# EAGLE schematic CDevBoard (EAGLE 9.6.2)

## Sheet 1 of 2
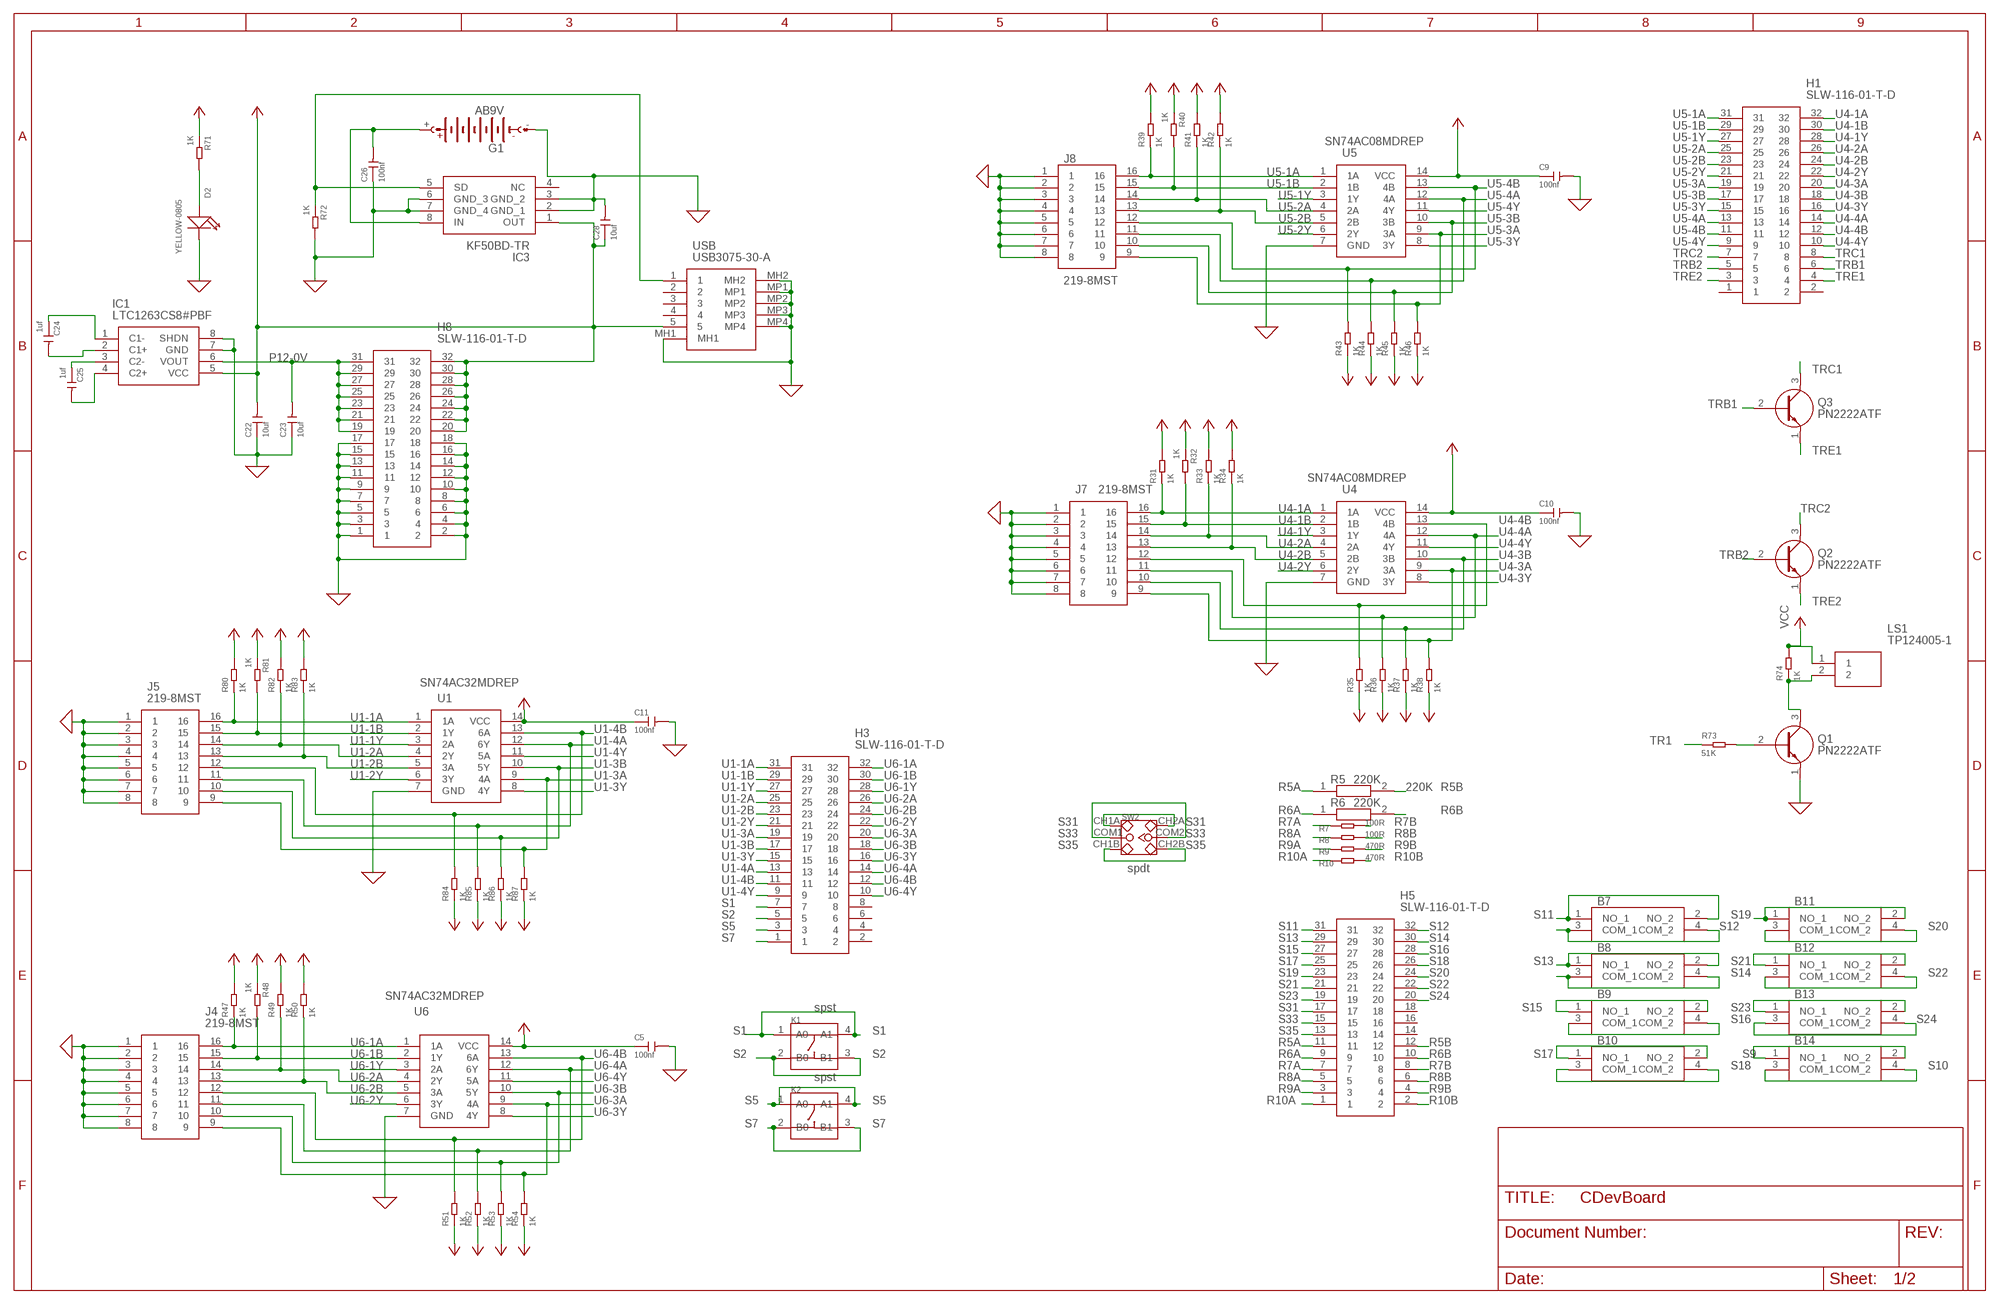
[diagram p0: schematic, sheet 1]

### Parts
B7  1301.9317  [13019317]
B8  1301.9317  [13019317]
B9  1301.9317  [13019317]
B10  1301.9317  [13019317]
B11  1301.9317  [13019317]
B12  1301.9317  [13019317]
B13  1301.9317  [13019317]
B14  1301.9317  [13019317]
C5  100nf  CERAMIC-100NF-25V-10%-X7R(0402)  [C0402]
C9  100nf  CERAMIC-100NF-25V-10%-X7R(0402)  [C0402]
C10  100nf  CERAMIC-100NF-25V-10%-X7R(0402)  [C0402]
C11  100nf  CERAMIC-100NF-25V-10%-X7R(0402)  [C0402]
C22  10uf  CERAMIC-10UF-25V-10%-X5R(0805)  [C0805]
C23  10uf  CERAMIC-10UF-25V-10%-X5R(0805)  [C0805]
C24  1uf  CERAMIC-1UF-25V-10%-X7R(0805)  [C0805]
C25  1uf  CERAMIC-1UF-25V-10%-X7R(0805)  [C0805]
C26  100nf  CERAMIC-100NF-50V-10%-X7R(0603)  [C0603]
C28  10uf  CERAMIC-10UF-25V-10%-X5R(0805)  [C0805]
D2  YELLOW-0805  SMD-LED-CLEAR-YELLOW(0805)  [LED-0805]
G1  AB9V  [AB9V]
H1  SLW-116-01-T-D  [SLW-116-01-X]
H3  SLW-116-01-T-D  [SLW-116-01-X]
H5  SLW-116-01-T-D  [SLW-116-01-X]
H8  SLW-116-01-T-D  [SLW-116-01-X]
IC1  LTC1263CS8#PBF  [SOIC127P599X175-8N]
IC3  KF50BD-TR  LM2936QHBMA-5.0_NOPB  [SOIC127P600X175-8N]
J4  219-8MST  [2198MST]
J5  219-8MST  [2198MST]
J7  219-8MST  [2198MST]
J8  219-8MST  [2198MST]
K1  SMD-SWITCH-TACTILE-SPST-NO(4P-D6.0MM)  [SW4-SMD-6.0X6.0X5.0MM]
K2  SMD-SWITCH-TACTILE-SPST-NO(4P-D6.0MM)  [SW4-SMD-6.0X6.0X5.0MM]
LS1  TP124005-1  [TP1240051]
Q1  PN2222ATF  [KA431AZTA]
Q2  PN2222ATF  [KA431AZTA]
Q3  PN2222ATF  [KA431AZTA]
R5  220K  CFR-25JR-52-100R  [RESAD1590W60L630D240]
R6  220K  CFR-25JR-52-100R  [RESAD1590W60L630D240]
R7  100R  DIP-RES-100R-5%-1/4W(PR-D2.3XL6.5MM)  [PR-D2.3XL6.5MM]
R8  100R  DIP-RES-100R-5%-1/4W(PR-D2.3XL6.5MM)  [PR-D2.3XL6.5MM]
R9  470R  DIP-RES-470R-5%-1/4W(PR-D2.3XL6.5MM)  [PR-D2.3XL6.5MM]
R10  470R  DIP-RES-470R-5%-1/4W(PR-D2.3XL6.5MM)  [PR-D2.3XL6.5MM]
R31  1K  SMD-RES-5.1K-1%-1/8W(0805)  [R0805]
R32  1K  SMD-RES-5.1K-1%-1/8W(0805)  [R0805]
R33  1K  SMD-RES-5.1K-1%-1/8W(0805)  [R0805]
R34  1K  SMD-RES-5.1K-1%-1/8W(0805)  [R0805]
R35  1K  SMD-RES-5.1K-1%-1/8W(0805)  [R0805]
R36  1K  SMD-RES-5.1K-1%-1/8W(0805)  [R0805]
R37  1K  SMD-RES-5.1K-1%-1/8W(0805)  [R0805]
R38  1K  SMD-RES-5.1K-1%-1/8W(0805)  [R0805]
R39  1K  SMD-RES-5.1K-1%-1/8W(0805)  [R0805]
R40  1K  SMD-RES-5.1K-1%-1/8W(0805)  [R0805]
R41  1K  SMD-RES-5.1K-1%-1/8W(0805)  [R0805]
R42  1K  SMD-RES-5.1K-1%-1/8W(0805)  [R0805]
R43  1K  SMD-RES-5.1K-1%-1/8W(0805)  [R0805]
R44  1K  SMD-RES-5.1K-1%-1/8W(0805)  [R0805]
R45  1K  SMD-RES-5.1K-1%-1/8W(0805)  [R0805]
R46  1K  SMD-RES-5.1K-1%-1/8W(0805)  [R0805]
R47  1K  SMD-RES-5.1K-1%-1/8W(0805)  [R0805]
R48  1K  SMD-RES-5.1K-1%-1/8W(0805)  [R0805]
R49  1K  SMD-RES-5.1K-1%-1/8W(0805)  [R0805]
R50  1K  SMD-RES-5.1K-1%-1/8W(0805)  [R0805]
R51  1K  SMD-RES-5.1K-1%-1/8W(0805)  [R0805]
R52  1K  SMD-RES-5.1K-1%-1/8W(0805)  [R0805]
R53  1K  SMD-RES-5.1K-1%-1/8W(0805)  [R0805]
R54  1K  SMD-RES-5.1K-1%-1/8W(0805)  [R0805]
R71  1K  SMD-RES-200R-1%-1/8W(0805)  [R0805]
R72  1K  SMD-RES-5.1K-1%-1/8W(0805)  [R0805]
R73  51K  SMD-RES-51K-1%-1/10W(0603)  [R0603]
R74  1K  SMD-RES-1K-1%-1/8W(0805)  [R0805]
R80  1K  SMD-RES-5.1K-1%-1/8W(0805)  [R0805]
R81  1K  SMD-RES-5.1K-1%-1/8W(0805)  [R0805]
R82  1K  SMD-RES-5.1K-1%-1/8W(0805)  [R0805]
R83  1K  SMD-RES-5.1K-1%-1/8W(0805)  [R0805]
R84  1K  SMD-RES-5.1K-1%-1/8W(0805)  [R0805]
R85  1K  SMD-RES-5.1K-1%-1/8W(0805)  [R0805]
R86  1K  SMD-RES-5.1K-1%-1/8W(0805)  [R0805]
R87  1K  SMD-RES-5.1K-1%-1/8W(0805)  [R0805]
SW2  DIP-TOGGLE-SWITCH-2CH-(2X3P-2.54)  [SW6-2.54-9.0X3.5X3.2+2.0MM]
U1  SN74AC04MDREP  [SOIC127P600X175-14N]
U4  SN74AC08MDREP  [SOIC127P600X175-14N]
U5  SN74AC08MDREP  [SOIC127P600X175-14N]
U6  SN74AC04MDREP  [SOIC127P600X175-14N]
USB  USB3075-30-A  [USB307530A]

### Nets
0 [Power]: C5.2 C9.2 C10.2 C11.2 C22.1 C23.1 C26.1 C28.2 D2.- G1.- H8.1 H8.2 H8.3 H8.4 H8.5 H8.6 H8.7 H8.8 H8.9 H8.10 H8.11 H8.12 H8.13 H8.14 H8.15 H8.16 H8.17 H8.18 IC1.7(GND) IC1.8(SHDN) IC3.2(GND_1) IC3.3(GND_2) IC3.6(GND_3) IC3.7(GND_4) J4.1 J4.2 J4.3 J4.4 J4.5 J4.6 J4.7 J4.8 J5.1 J5.2 J5.3 J5.4 J5.5 J5.6 J5.7 J5.8 J7.1 J7.2 J7.3 J7.4 J7.5 J7.6 J7.7 J7.8 J8.1 J8.2 J8.3 J8.4 J8.5 J8.6 J8.7 J8.8 Q1.1(E) R72.2 U1.7(GND) U4.7(GND) U5.7(GND) U6.7(GND) USB.MH1 USB.MH2 USB.MP1 USB.MP2 USB.MP3 USB.MP4 ; supply symbol labelled GND ; also sheet 2
N$2: Q1.2(B) R73.2
N$3: LS1.2 Q1.3(C) R74.1
N$4: IC3.5(SD) R72.1 USB.1
N$5: C24.1 IC1.1(C1-)
N$6: C24.2 IC1.2(C1+)
N$7: C25.1 IC1.3(C2-)
N$8: C25.2 IC1.4(C2+)
N$11: C26.2 G1.+ IC3.8(IN)
N$67: D2.+ R71.2
P12-0V: C23.2 H8.19 H8.21 H8.23 H8.25 H8.27 H8.29 H8.31 IC1.6(VOUT)
R5A: H5.11 R5.1
R5B: H5.12 R5.2
R6A: H5.9 R6.1
R6B: H5.10 R6.2
R7A: H5.7 R7.1
R7B: H5.8 R7.2
R8A: H5.5 R8.1
R8B: H5.6 R8.2
R9A: H5.3 R9.1
R9B: H5.4 R9.2
R10A: H5.1 R10.1
R10B: H5.2 R10.2
S1: H3.7 K1.1(A0) K1.4(A1)
S2: H3.5 K1.2(B0) K1.3(B1)
S5: H3.3 K2.1(A0) K2.4(A1)
S7: H3.1 K2.2(B0) K2.3(B1)
S9: B14.1(NO_1) B14.2(NO_2) ; also sheet 2
S10: B14.3(COM_1) B14.4(COM_2) ; also sheet 2
S11: B7.1(NO_1) B7.2(NO_2) H5.31
S12: B7.3(COM_1) B7.4(COM_2) H5.32
S13: B8.1(NO_1) B8.2(NO_2) H5.29
S14: B8.3(COM_1) B8.4(COM_2) H5.30
S15: B9.1(NO_1) B9.2(NO_2) H5.27
S16: B9.3(COM_1) B9.4(COM_2) H5.28
S17: B10.1(NO_1) B10.2(NO_2) H5.25
S18: B10.3(COM_1) B10.4(COM_2) H5.26
S19: B11.1(NO_1) B11.2(NO_2) H5.23
S20: B11.3(COM_1) B11.4(COM_2) H5.24
S21: B12.1(NO_1) B12.2(NO_2) H5.21
S22: B12.3(COM_1) B12.4(COM_2) H5.22
S23: B13.1(NO_1) B13.2(NO_2) H5.19
S24: B13.3(COM_1) B13.4(COM_2) H5.20
S31: H5.17 SW2.CH1A SW2.CH2A
S33: H5.15 SW2.COM1 SW2.COM2
S35: H5.13 SW2.CH1B SW2.CH2B
TR1: R73.1 ; also sheet 2
TRB1: H1.6 Q3.2(B)
TRB2: H1.5 Q2.2(B)
TRC1: H1.8 Q3.3(C)
TRC2: H1.7 Q2.3(C)
TRE1: H1.4 Q3.1(E)
TRE2: H1.3 Q2.1(E)
U1-1A: H3.31 J5.16 R80.1 U1.1(1A)
U1-1B: H3.29 J5.15 R81.2 U1.2(1Y)
U1-1Y: H3.27 U1.3(2A)
U1-2A: H3.25 J5.14 R82.1 U1.4(2Y)
U1-2B: H3.23 J5.13 R83.1 U1.5(3A)
U1-2Y: H3.21 U1.6(3Y)
U1-3A: H3.19 J5.9 R87.2 U1.9(4A)
U1-3B: H3.17 J5.10 R86.2 U1.10(5Y)
U1-3Y: H3.15 U1.8(4Y)
U1-4A: H3.13 J5.11 R85.2 U1.12(6Y)
U1-4B: H3.11 J5.12 R84.2 U1.13(6A)
U1-4Y: H3.9 U1.11(5A)
U4-1A: H1.32 J7.16 R31.1 U4.1(1A)
U4-1B: H1.30 J7.15 R32.2 U4.2(1B)
U4-1Y: H1.28 U4.3(1Y)
U4-2A: H1.26 J7.14 R33.1 U4.4(2A)
U4-2B: H1.24 J7.13 R34.1 U4.5(2B)
U4-2Y: H1.22 U4.6(2Y)
U4-3A: H1.20 J7.9 R38.2 U4.9(3A)
U4-3B: H1.18 J7.10 R37.2 U4.10(3B)
U4-3Y: H1.16 U4.8(3Y)
U4-4A: H1.14 J7.11 R36.2 U4.12(4A)
U4-4B: H1.12 J7.12 R35.2 U4.13(4B)
U4-4Y: H1.10 U4.11(4Y)
U5-1A: H1.31 J8.16 R39.1 U5.1(1A)
U5-1B: H1.29 J8.15 R40.2 U5.2(1B)
U5-1Y: H1.27 U5.3(1Y)
U5-2A: H1.25 J8.14 R41.1 U5.4(2A)
U5-2B: H1.23 J8.13 R42.1 U5.5(2B)
U5-2Y: H1.21 U5.6(2Y)
U5-3A: H1.19 J8.9 R46.2 U5.9(3A)
U5-3B: H1.17 J8.10 R45.2 U5.10(3B)
U5-3Y: H1.15 U5.8(3Y)
U5-4A: H1.13 J8.11 R44.2 U5.12(4A)
U5-4B: H1.11 J8.12 R43.2 U5.13(4B)
U5-4Y: H1.9 U5.11(4Y)
U6-1A: H3.32 J4.16 R47.1 U6.1(1A)
U6-1B: H3.30 J4.15 R48.2 U6.2(1Y)
U6-1Y: H3.28 U6.3(2A)
U6-2A: H3.26 J4.14 R49.1 U6.4(2Y)
U6-2B: H3.24 J4.13 R50.1 U6.5(3A)
U6-2Y: H3.22 U6.6(3Y)
U6-3A: H3.20 J4.9 R54.2 U6.9(4A)
U6-3B: H3.18 J4.10 R53.2 U6.10(5Y)
U6-3Y: H3.16 U6.8(4Y)
U6-4A: H3.14 J4.11 R52.2 U6.12(6Y)
U6-4B: H3.12 J4.12 R51.2 U6.13(6A)
U6-4Y: H3.10 U6.11(5A)
VCC [Power]: C5.1 C9.1 C10.1 C11.1 C22.2 C28.1 H8.20 H8.22 H8.24 H8.26 H8.28 H8.30 H8.32 IC1.5(VCC) IC3.1(OUT) LS1.1 R31.2 R32.1 R33.2 R34.2 R35.1 R36.1 R37.1 R38.1 R39.2 R40.1 R41.2 R42.2 R43.1 R44.1 R45.1 R46.1 R47.2 R48.1 R49.2 R50.2 R51.1 R52.1 R53.1 R54.1 R71.1 R74.2 R80.2 R81.1 R82.2 R83.2 R84.1 R85.1 R86.1 R87.1 U1.14(VCC) U4.14(VCC) U5.14(VCC) U6.14(VCC) USB.5 ; also sheet 2
Unconnected: H1.1 H1.2 H3.2 H3.4 H3.6 H3.8 H5.14 H5.16 H5.18 IC3.4(NC) USB.2 USB.3 USB.4

## Sheet 2 of 2
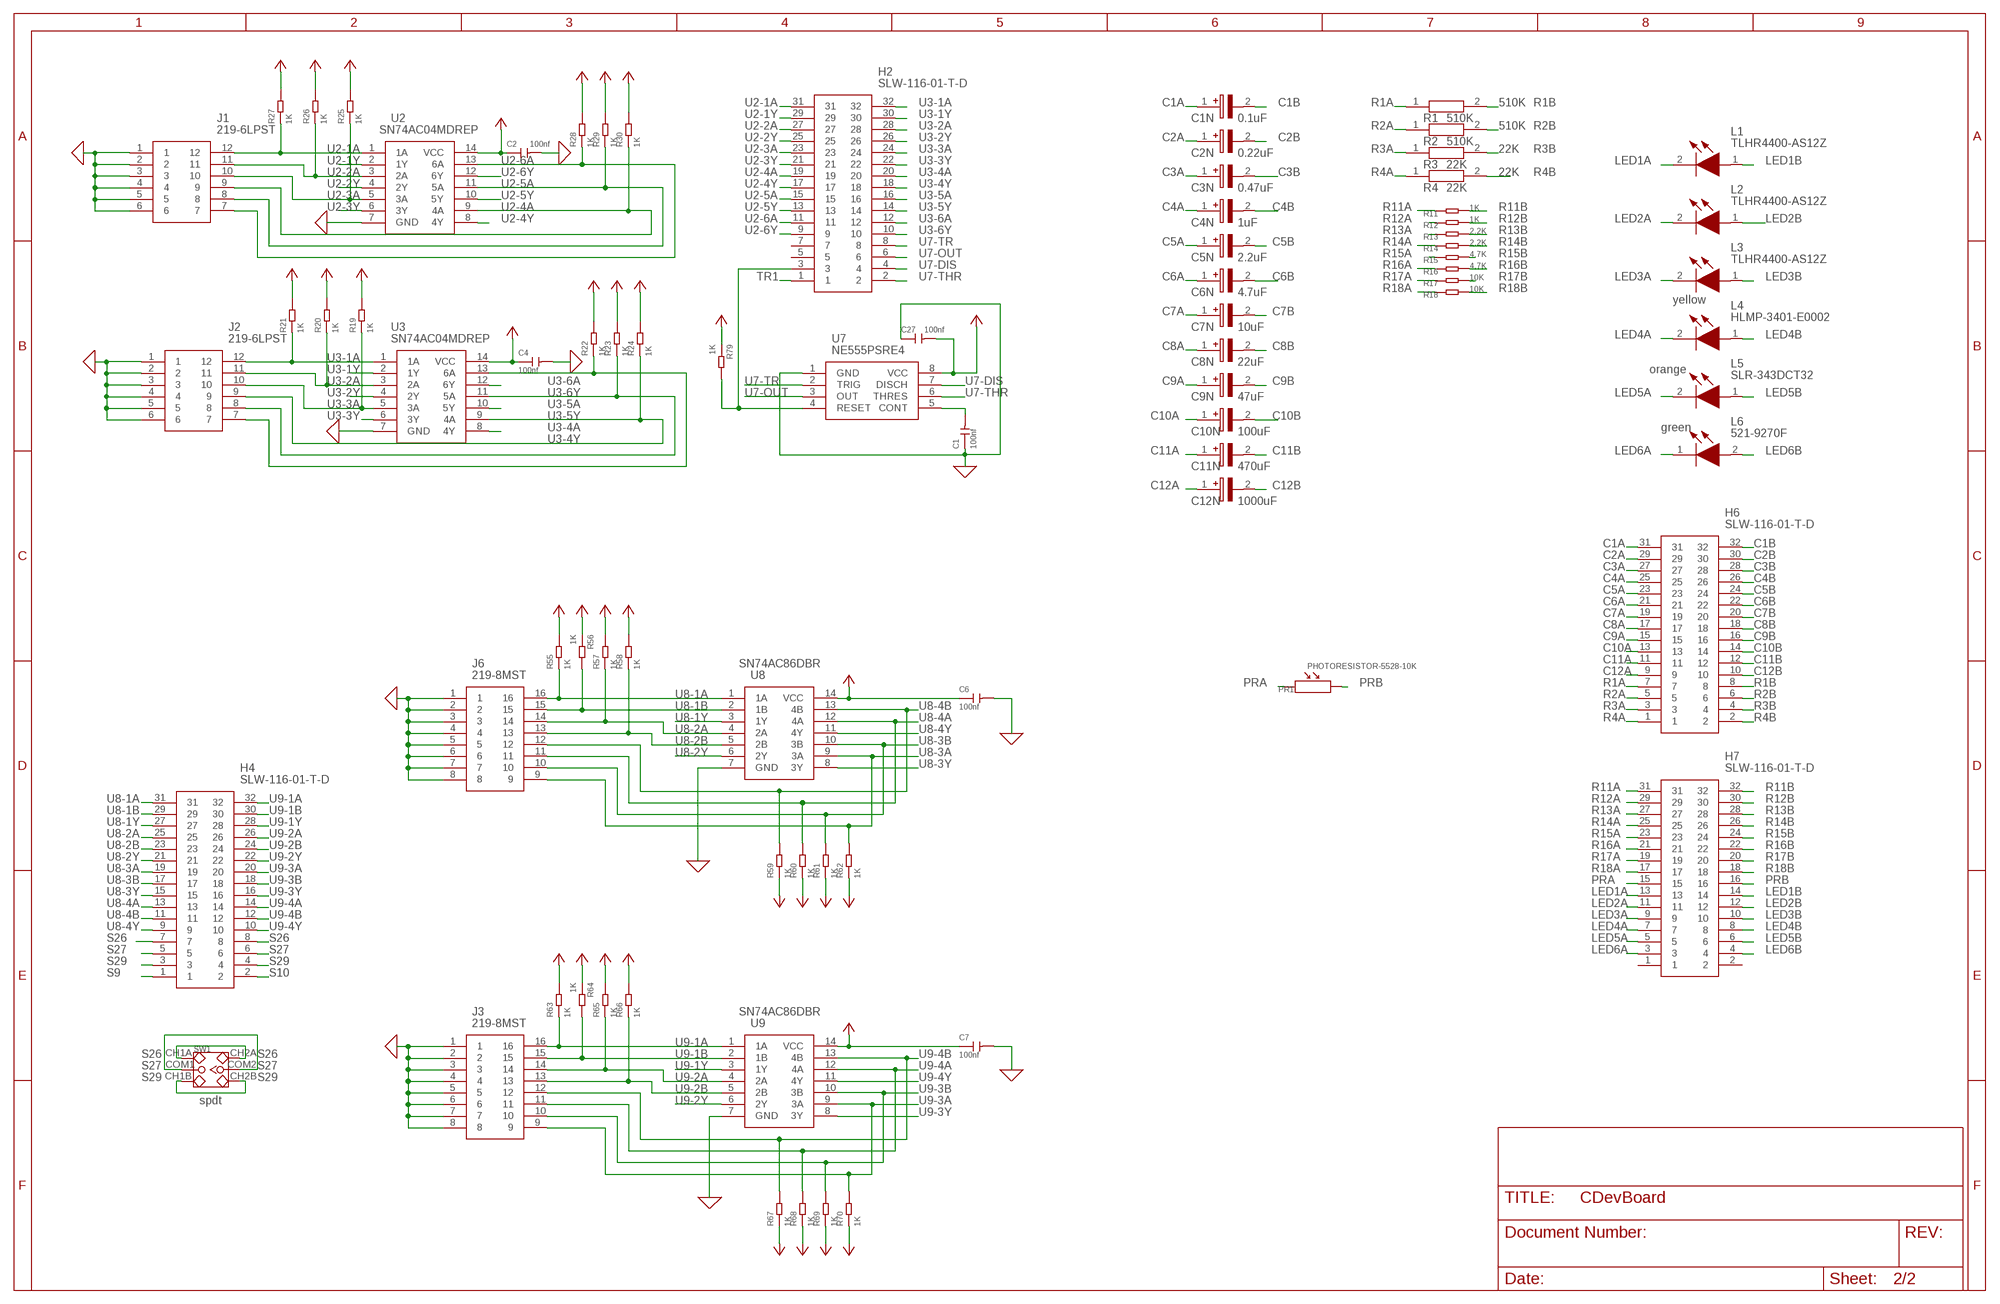
[diagram p1: schematic, sheet 2]

### Parts
C1  100nf  CERAMIC-100NF-25V-10%-X7R(0402)  [C0402]
C1N  0.1uF  860010672001  [CAPPRD200W52D500H1250]
C2  100nf  CERAMIC-100NF-25V-10%-X7R(0402)  [C0402]
C2N  0.22uF  860010672001  [CAPPRD200W52D500H1250]
C3N  0.47uF  860010672001  [CAPPRD200W52D500H1250]
C4  100nf  CERAMIC-100NF-25V-10%-X7R(0402)  [C0402]
C4N  1uF  860010672001  [CAPPRD200W52D500H1250]
C5N  2.2uF  860020672006  [CAPPRD200W52D500H1250]
C6  100nf  CERAMIC-100NF-25V-10%-X7R(0402)  [C0402]
C6N  4.7uF  860020672006  [CAPPRD200W52D500H1250]
C7  100nf  CERAMIC-100NF-25V-10%-X7R(0402)  [C0402]
C7N  10uF  ESK106M010AC3AA  [CAPPRD200W50D500H1250]
C8N  22uF  860010272003  [CAPPRD200W52D500H1250]
C9N  47uF  860010272003  [CAPPRD200W52D500H1250]
C10N  100uF  860010272003  [CAPPRD200W52D500H1250]
C11N  470uF  860010272003  [CAPPRD200W52D500H1250]
C12N  1000uF  860010272003  [CAPPRD200W52D500H1250]
C27  100nf  CERAMIC-100NF-25V-10%-X7R(0402)  [C0402]
H2  SLW-116-01-T-D  [SLW-116-01-X]
H4  SLW-116-01-T-D  [SLW-116-01-X]
H6  SLW-116-01-T-D  [SLW-116-01-X]
H7  SLW-116-01-T-D  [SLW-116-01-X]
J1  219-6LPST  [2196LPST]
J2  219-6LPST  [2196LPST]
J3  219-8MST  [2198MST]
J6  219-8MST  [2198MST]
L1  TLHR4400-AS12Z  [TLHR4400AS12Z]
L2  TLHR4400-AS12Z  [TLHR4400AS12Z]
L3  TLHR4400-AS12Z  [TLHR4400AS12Z]
L4  HLMP-3401-E0002  [HLMP3401E0002]
L5  SLR-343DCT32  [SLR343DCT32]
L6  521-9270F  [5219270F]
PR1  PHOTORESISTOR-5528-10K  PHOTORESISTOR-5528-10K(2P-5.0X4.2MM)  [SNR2-3.0]
R1  510K  CFR-25JR-52-100R  [RESAD1590W60L630D240]
R2  510K  CFR-25JR-52-100R  [RESAD1590W60L630D240]
R3  22K  CFR-25JR-52-100R  [RESAD1590W60L630D240]
R4  22K  CFR-25JR-52-100R  [RESAD1590W60L630D240]
R11  1K  DIP-RES-1K-5%-1/4W(PR-D2.3XL6.5MM)  [PR-D2.3XL6.5MM]
R12  1K  DIP-RES-1K-5%-1/4W(PR-D2.3XL6.5MM)  [PR-D2.3XL6.5MM]
R13  2.2K  DIP-RES-2.2K-5%-1/4W(PR-D2.3XL6.5MM)  [PR-D2.3XL6.5MM]
R14  2.2K  DIP-RES-2.2K-5%-1/4W(PR-D2.3XL6.5MM)  [PR-D2.3XL6.5MM]
R15  4.7K  DIP-RES-4.7K-5%-1/4W(PR-D2.3XL6.5MM)  [PR-D2.3XL6.5MM]
R16  4.7K  DIP-RES-4.7K-5%-1/4W(PR-D2.3XL6.5MM)  [PR-D2.3XL6.5MM]
R17  10K  DIP-RES-10K-5%-1/4W(PR-D2.3XL6.5MM)  [PR-D2.3XL6.5MM]
R18  10K  DIP-RES-10K-5%-1/4W(PR-D2.3XL6.5MM)  [PR-D2.3XL6.5MM]
R19  1K  SMD-RES-5.1K-1%-1/8W(0805)  [R0805]
R20  1K  SMD-RES-5.1K-1%-1/8W(0805)  [R0805]
R21  1K  SMD-RES-5.1K-1%-1/8W(0805)  [R0805]
R22  1K  SMD-RES-5.1K-1%-1/8W(0805)  [R0805]
R23  1K  SMD-RES-5.1K-1%-1/8W(0805)  [R0805]
R24  1K  SMD-RES-5.1K-1%-1/8W(0805)  [R0805]
R25  1K  SMD-RES-5.1K-1%-1/8W(0805)  [R0805]
R26  1K  SMD-RES-5.1K-1%-1/8W(0805)  [R0805]
R27  1K  SMD-RES-5.1K-1%-1/8W(0805)  [R0805]
R28  1K  SMD-RES-5.1K-1%-1/8W(0805)  [R0805]
R29  1K  SMD-RES-5.1K-1%-1/8W(0805)  [R0805]
R30  1K  SMD-RES-5.1K-1%-1/8W(0805)  [R0805]
R55  1K  SMD-RES-5.1K-1%-1/8W(0805)  [R0805]
R56  1K  SMD-RES-5.1K-1%-1/8W(0805)  [R0805]
R57  1K  SMD-RES-5.1K-1%-1/8W(0805)  [R0805]
R58  1K  SMD-RES-5.1K-1%-1/8W(0805)  [R0805]
R59  1K  SMD-RES-5.1K-1%-1/8W(0805)  [R0805]
R60  1K  SMD-RES-5.1K-1%-1/8W(0805)  [R0805]
R61  1K  SMD-RES-5.1K-1%-1/8W(0805)  [R0805]
R62  1K  SMD-RES-5.1K-1%-1/8W(0805)  [R0805]
R63  1K  SMD-RES-5.1K-1%-1/8W(0805)  [R0805]
R64  1K  SMD-RES-5.1K-1%-1/8W(0805)  [R0805]
R65  1K  SMD-RES-5.1K-1%-1/8W(0805)  [R0805]
R66  1K  SMD-RES-5.1K-1%-1/8W(0805)  [R0805]
R67  1K  SMD-RES-5.1K-1%-1/8W(0805)  [R0805]
R68  1K  SMD-RES-5.1K-1%-1/8W(0805)  [R0805]
R69  1K  SMD-RES-5.1K-1%-1/8W(0805)  [R0805]
R70  1K  SMD-RES-5.1K-1%-1/8W(0805)  [R0805]
R79  1K  SMD-RES-5.1K-1%-1/8W(0805)  [R0805]
SW1  DIP-TOGGLE-SWITCH-2CH-(2X3P-2.54)  [SW6-2.54-9.0X3.5X3.2+2.0MM]
U2  SN74AC04MDREP  [SOIC127P600X175-14N]
U3  SN74AC04MDREP  [SOIC127P600X175-14N]
U7  NE555PSRE4  [SOIC127P780X200-8N]
U8  SN74AC86DBR  [SOP65P780X200-14N]
U9  SN74AC86DBR  [SOP65P780X200-14N]

### Nets
0 [Power]: C1.1 C2.2 C4.2 C6.2 C7.2 C27.1 J1.1 J1.2 J1.3 J1.4 J1.5 J1.6 J2.1 J2.2 J2.3 J2.4 J2.5 J2.6 J3.1 J3.2 J3.3 J3.4 J3.5 J3.6 J3.7 J3.8 J6.1 J6.2 J6.3 J6.4 J6.5 J6.6 J6.7 J6.8 U2.7(GND) U3.7(GND) U7.1(GND) U8.7(GND) U9.7(GND) ; supply symbol labelled GND ; also sheet 1
C1A: C1N.1(+) H6.31
C1B: C1N.2(-) H6.32
C2A: C2N.1(+) H6.29
C2B: C2N.2(-) H6.30
C3A: C3N.1(+) H6.27
C3B: C3N.2(-) H6.28
C4A: C4N.1(+) H6.25
C4B: C4N.2(-) H6.26
C5A: C5N.1(+) H6.23
C5B: C5N.2(-) H6.24
C6A: C6N.1(+) H6.21
C6B: C6N.2(-) H6.22
C7A: C7N.1(+) H6.19
C7B: C7N.2(-) H6.20
C8A: C8N.1(+) H6.17
C8B: C8N.2(-) H6.18
C9A: C9N.1(+) H6.15
C9B: C9N.2(-) H6.16
C10A: C10N.1(+) H6.13
C10B: C10N.2(-) H6.14
C11A: C11N.1(+) H6.11
C11B: C11N.2(-) H6.12
C12A: C12N.1(+) H6.9
C12B: C12N.2(-) H6.10
LED1A: H7.13 L1.2(K)
LED1B: H7.14 L1.1(A)
LED2A: H7.11 L2.2(K)
LED2B: H7.12 L2.1(A)
LED3A: H7.9 L3.2(K)
LED3B: H7.10 L3.1(A)
LED4A: H7.7 L4.2(K)
LED4B: H7.8 L4.1(A)
LED5A: H7.5 L5.2(K)
LED5B: H7.6 L5.1(A)
LED6A: H7.3 L6.1(K)
LED6B: H7.4 L6.2(A)
N$1: C1.2 U7.5(CONT)
N$165: H2.3 R79.2 U7.4(RESET)
PRA: H7.15 PR1.1
PRB: H7.16 PR1.2
R1A: H6.7 R1.1
R1B: H6.8 R1.2
R2A: H6.5 R2.1
R2B: H6.6 R2.2
R3A: H6.3 R3.1
R3B: H6.4 R3.2
R4A: H6.1 R4.1
R4B: H6.2 R4.2
R11A: H7.31 R11.1
R11B: H7.32 R11.2
R12A: H7.29 R12.1
R12B: H7.30 R12.2
R13A: H7.27 R13.1
R13B: H7.28 R13.2
R14A: H7.25 R14.1
R14B: H7.26 R14.2
R15A: H7.23 R15.1
R15B: H7.24 R15.2
R16A: H7.21 R16.1
R16B: H7.22 R16.2
R17A: H7.19 R17.1
R17B: H7.20 R17.2
R18A: H7.17 R18.1
R18B: H7.18 R18.2
S9: H4.1 ; also sheet 1
S10: H4.2 ; also sheet 1
S26: H4.7 H4.8 SW1.CH1A SW1.CH2A
S27: H4.5 H4.6 SW1.COM1 SW1.COM2
S29: H4.3 H4.4 SW1.CH1B SW1.CH2B
TR1: H2.1 ; also sheet 1
U2-1A: H2.31 J1.12 R27.1 U2.1(1A)
U2-1Y: H2.29 U2.2(1Y)
U2-2A: H2.27 J1.11 R26.1 U2.3(2A)
U2-2Y: H2.25 U2.4(2Y)
U2-3A: H2.23 J1.10 R25.1 U2.5(3A)
U2-3Y: H2.21 U2.6(3Y)
U2-4A: H2.19 J1.9 R30.1 U2.9(4A)
U2-4Y: H2.17 U2.8(4Y)
U2-5A: H2.15 J1.8 R29.1 U2.11(5A)
U2-5Y: H2.13 U2.10(5Y)
U2-6A: H2.11 J1.7 R28.1 U2.13(6A)
U2-6Y: H2.9 U2.12(6Y)
U3-1A: H2.32 J2.12 R21.1 U3.1(1A)
U3-1Y: H2.30 U3.2(1Y)
U3-2A: H2.28 J2.11 R20.1 U3.3(2A)
U3-2Y: H2.26 U3.4(2Y)
U3-3A: H2.24 J2.10 R19.1 U3.5(3A)
U3-3Y: H2.22 U3.6(3Y)
U3-4A: H2.20 J2.9 R24.1 U3.9(4A)
U3-4Y: H2.18 U3.8(4Y)
U3-5A: H2.16 J2.8 R23.1 U3.11(5A)
U3-5Y: H2.14 U3.10(5Y)
U3-6A: H2.12 J2.7 R22.1 U3.13(6A)
U3-6Y: H2.10 U3.12(6Y)
U7-DIS: H2.4 U7.7(DISCH)
U7-OUT: H2.6 U7.3(OUT)
U7-THR: H2.2 U7.6(THRES)
U7-TR: H2.8 U7.2(TRIG)
U8-1A: H4.31 J6.16 R55.1 U8.1(1A)
U8-1B: H4.29 J6.15 R56.2 U8.2(1B)
U8-1Y: H4.27 U8.3(1Y)
U8-2A: H4.25 J6.14 R57.1 U8.4(2A)
U8-2B: H4.23 J6.13 R58.1 U8.5(2B)
U8-2Y: H4.21 U8.6(2Y)
U8-3A: H4.19 J6.9 R62.2 U8.9(3A)
U8-3B: H4.17 J6.10 R61.2 U8.10(3B)
U8-3Y: H4.15 U8.8(3Y)
U8-4A: H4.13 J6.11 R60.2 U8.12(4A)
U8-4B: H4.11 J6.12 R59.2 U8.13(4B)
U8-4Y: H4.9 U8.11(4Y)
U9-1A: H4.32 J3.16 R63.1 U9.1(1A)
U9-1B: H4.30 J3.15 R64.2 U9.2(1B)
U9-1Y: H4.28 U9.3(1Y)
U9-2A: H4.26 J3.14 R65.1 U9.4(2A)
U9-2B: H4.24 J3.13 R66.1 U9.5(2B)
U9-2Y: H4.22 U9.6(2Y)
U9-3A: H4.20 J3.9 R70.2 U9.9(3A)
U9-3B: H4.18 J3.10 R69.2 U9.10(3B)
U9-3Y: H4.16 U9.8(3Y)
U9-4A: H4.14 J3.11 R68.2 U9.12(4A)
U9-4B: H4.12 J3.12 R67.2 U9.13(4B)
U9-4Y: H4.10 U9.11(4Y)
VCC [Power]: C2.1 C4.1 C6.1 C7.1 C27.2 R19.2 R20.2 R21.2 R22.2 R23.2 R24.2 R25.2 R26.2 R27.2 R28.2 R29.2 R30.2 R55.2 R56.1 R57.2 R58.2 R59.1 R60.1 R61.1 R62.1 R63.2 R64.1 R65.2 R66.2 R67.1 R68.1 R69.1 R70.1 R79.1 U2.14(VCC) U3.14(VCC) U7.8(VCC) U8.14(VCC) U9.14(VCC) ; also sheet 1
Unconnected: H2.5 H2.7 H7.1 H7.2

## Library data of the parts
B7-B14 = 1301.9317:1301.9317: Tactile Switches SHORT TRAVEL SWITCH 6X6, 7.3MM Source: Datasheet <https://componentsearchengine.com/Datasheets/2/1301.9317.pdf>; DESCRIPTION: Tactile Switches SHORT TRAVEL SWITCH 6X6, 7.3MM; HEIGHT: 7.3mm; MANUFACTURER_NAME: SCHURTER; MANUFACTURER_PART_NUMBER: 1301.9317; MOUSER_PART_NUMBER: 693-1301.9317; MOUSER_PRICE-STOCK: https://www.mouser.co.uk/ProductDetail/Schurter/13019317?qs=tGaZrb6HVSau8MWDkwnHyw%3D%3D
C1 C2 C4-C7 C9-C11 C27 = OPL_Capacitor:CERAMIC-100NF-25V-10%-X7R(0402): 302010024; MPN: CC0402KRX7R8BB104
C1N = 860010672001:860010672001: WURTH ELEKTRONIK - 860010672001 - CAP, ALU ELEC, 0.1UF, 50V, RADIAL Source: Datasheet <http://katalog.we-online.com/pbs/datasheet/860010672001.pdf>; DESCRIPTION: WURTH ELEKTRONIK - 860010672001 - CAP, ALU ELEC, 0.1UF, 50V, RADIAL; HEIGHT: 12.5mm; MANUFACTURER_NAME: Wurth Elektronik; MANUFACTURER_PART_NUMBER: 860010672001; MOUSER_PART_NUMBER: 710-860010672001; MOUSER_PRICE-STOCK: https://www.mouser.co.uk/ProductDetail/Wurth-Elektronik/860010672001?qs=0KOYDY2FL2%252BAjnDJgnKoow%3D%3D; VAL: 0.1uF
C2N = 860010672001:860010672001: WURTH ELEKTRONIK - 860010672001 - CAP, ALU ELEC, 0.1UF, 50V, RADIAL Source: Datasheet <http://katalog.we-online.com/pbs/datasheet/860010672001.pdf>; DESCRIPTION: WURTH ELEKTRONIK - 860010672001 - CAP, ALU ELEC, 0.1UF, 50V, RADIAL; HEIGHT: 12.5mm; MANUFACTURER_NAME: Wurth Elektronik; MANUFACTURER_PART_NUMBER: 860010672001; MOUSER_PART_NUMBER: 710-860010672001; MOUSER_PRICE-STOCK: https://www.mouser.co.uk/ProductDetail/Wurth-Elektronik/860010672001?qs=0KOYDY2FL2%252BAjnDJgnKoow%3D%3D; VAL: 0.22uF
C3N = 860010672001:860010672001: WURTH ELEKTRONIK - 860010672001 - CAP, ALU ELEC, 0.1UF, 50V, RADIAL Source: Datasheet <http://katalog.we-online.com/pbs/datasheet/860010672001.pdf>; DESCRIPTION: WURTH ELEKTRONIK - 860010672001 - CAP, ALU ELEC, 0.1UF, 50V, RADIAL; HEIGHT: 12.5mm; MANUFACTURER_NAME: Wurth Elektronik; MANUFACTURER_PART_NUMBER: 860010672001; MOUSER_PART_NUMBER: 710-860010672001; MOUSER_PRICE-STOCK: https://www.mouser.co.uk/ProductDetail/Wurth-Elektronik/860010672001?qs=0KOYDY2FL2%252BAjnDJgnKoow%3D%3D; VAL: 0.47uF
C4N = 860010672001:860010672001: WURTH ELEKTRONIK - 860010672001 - CAP, ALU ELEC, 0.1UF, 50V, RADIAL Source: Datasheet <http://katalog.we-online.com/pbs/datasheet/860010672001.pdf>; DESCRIPTION: WURTH ELEKTRONIK - 860010672001 - CAP, ALU ELEC, 0.1UF, 50V, RADIAL; HEIGHT: 12.5mm; MANUFACTURER_NAME: Wurth Elektronik; MANUFACTURER_PART_NUMBER: 860010672001; MOUSER_PART_NUMBER: 710-860010672001; MOUSER_PRICE-STOCK: https://www.mouser.co.uk/ProductDetail/Wurth-Elektronik/860010672001?qs=0KOYDY2FL2%252BAjnDJgnKoow%3D%3D; VAL: 1uF
C5N = 860020672006:860020672006: Wurth Elektronik 2.2uF 50 V dc Aluminium Electrolytic Capacitor, WCAP-ATG5 Series 2000h 5 (Dia.) x 11mm Source: Datasheet <https://componentsearchengine.com/Datasheets/1/860020672006.pdf>; DESCRIPTION: Wurth Elektronik 2.2uF 50 V dc Aluminium Electrolytic Capacitor, WCAP-ATG5 Series 2000h 5 (Dia.) x 11mm; HEIGHT: 12.5mm; MANUFACTURER_NAME: Wurth Elektronik; MANUFACTURER_PART_NUMBER: 860020672006; MOUSER_PART_NUMBER: 710-860020672006; MOUSER_PRICE-STOCK: https://www.mouser.com/Search/Refine.aspx?Keyword=710-860020672006; VAL: 2.2uF
C6N = 860020672006:860020672006: Wurth Elektronik 2.2uF 50 V dc Aluminium Electrolytic Capacitor, WCAP-ATG5 Series 2000h 5 (Dia.) x 11mm Source: Datasheet <https://componentsearchengine.com/Datasheets/1/860020672006.pdf>; DESCRIPTION: Wurth Elektronik 2.2uF 50 V dc Aluminium Electrolytic Capacitor, WCAP-ATG5 Series 2000h 5 (Dia.) x 11mm; HEIGHT: 12.5mm; MANUFACTURER_NAME: Wurth Elektronik; MANUFACTURER_PART_NUMBER: 860020672006; MOUSER_PART_NUMBER: 710-860020672006; MOUSER_PRICE-STOCK: https://www.mouser.com/Search/Refine.aspx?Keyword=710-860020672006
C7N = ESK106M010AC3AA:ESK106M010AC3AA: Aluminum Electrolytic Capacitors - Radial Leaded 10V 10uF 85C 2k Hour Radial Source: Datasheet <https://api.kemet.com/component-edge/download/datasheet/ESK106M010AC3AA.pdf>; DESCRIPTION: Aluminum Electrolytic Capacitors - Radial Leaded 10V 10uF 85C 2k Hour Radial; HEIGHT: 12.5mm; MANUFACTURER_NAME: Kemet; MANUFACTURER_PART_NUMBER: ESK106M010AC3AA; MOUSER_PART_NUMBER: 80-ESK106M010AC3AA; MOUSER_PRICE-STOCK: https://www.mouser.co.uk/ProductDetail/KEMET/ESK106M010AC3AA?qs=F5EMLAvA7IABDytm%252BsP%2FVA%3D%3D; VAL: 10uF
C8N = 860010272003:860010272003: Wurth Elektronik 47uF Electrolytic Capacitor 10V dc, Through Hole - 860010272003 Source: Datasheet; DESCRIPTION: Wurth Elektronik 47uF Electrolytic Capacitor 10V dc, Through Hole - 860010272003; HEIGHT: 12.5mm; MANUFACTURER_NAME: Wurth Elektronik; MANUFACTURER_PART_NUMBER: 860010272003; VAL: 22uF
C9N = 860010272003:860010272003: Wurth Elektronik 47uF Electrolytic Capacitor 10V dc, Through Hole - 860010272003 Source: Datasheet; DESCRIPTION: Wurth Elektronik 47uF Electrolytic Capacitor 10V dc, Through Hole - 860010272003; HEIGHT: 12.5mm; MANUFACTURER_NAME: Wurth Elektronik; MANUFACTURER_PART_NUMBER: 860010272003; VAL: 47uF
C10N = 860010272003:860010272003: Wurth Elektronik 47uF Electrolytic Capacitor 10V dc, Through Hole - 860010272003 Source: Datasheet; DESCRIPTION: Wurth Elektronik 47uF Electrolytic Capacitor 10V dc, Through Hole - 860010272003; HEIGHT: 12.5mm; MANUFACTURER_NAME: Wurth Elektronik; MANUFACTURER_PART_NUMBER: 860010272003; VAL: 100uF
C11N = 860010272003:860010272003: Wurth Elektronik 47uF Electrolytic Capacitor 10V dc, Through Hole - 860010272003 Source: Datasheet; DESCRIPTION: Wurth Elektronik 47uF Electrolytic Capacitor 10V dc, Through Hole - 860010272003; HEIGHT: 12.5mm; MANUFACTURER_NAME: Wurth Elektronik; MANUFACTURER_PART_NUMBER: 860010272003; VAL: 470uF
C12N = 860010272003:860010272003: Wurth Elektronik 47uF Electrolytic Capacitor 10V dc, Through Hole - 860010272003 Source: Datasheet; DESCRIPTION: Wurth Elektronik 47uF Electrolytic Capacitor 10V dc, Through Hole - 860010272003; HEIGHT: 12.5mm; MANUFACTURER_NAME: Wurth Elektronik; MANUFACTURER_PART_NUMBER: 860010272003; VAL: 1000uF
C22 C23 C28 = OPL_Capacitor:CERAMIC-10UF-25V-10%-X5R(0805): 302010178; MPN: CC0805KKX5R8BB106
C24 C25 = OPL_Capacitor:CERAMIC-1UF-25V-10%-X7R(0805): 302010179; MPN: CC0805KKX7R8BB105
C26 = OPL_Capacitor:CERAMIC-100NF-50V-10%-X7R(0603): 302010138; MPN: CC0603KRX7R9BB104
D2 = OPL_Optoelectronics:SMD-LED-CLEAR-YELLOW(0805): 304090039; MPN: 17-215UYC/S530-A3/TR8
G1 = battery:AB9V: 9-V BATTERY CLIP
H1-H8 = SLW-116-01-T-D:SLW-116-01-T-D: 32 Position, .100" Tiger Buy™ Low Profile Socket Strip, Single-Row Source: Datasheet <http://suddendocs.samtec.com/prints/slw-1xx-01-x-x-mkt.pdf>; DESCRIPTION: 32 Position, .100&quot; Tiger Buy&trade; Low Profile Socket Strip, Single-Row; HEIGHT: mm; MANUFACTURER_NAME: SAMTEC; MANUFACTURER_PART_NUMBER: SLW-116-01-T-D; MOUSER_PART_NUMBER: 200-SLW11601TD; MOUSER_PRICE-STOCK: https://www.mouser.co.uk/ProductDetail/Samtec/SLW-116-01-T-D?qs=rU5fayqh%252BE2OQX3w8Tc2Ew%3D%3D
IC1 = LTC1263CS8#PBF:LTC1263CS8#PBF: Linear Technology LTC1263CS8#PBF, 1-Channel, Step Up DC-DC Converter, Adjustable 8-Pin, SOIC Source: Datasheet <http://www.linear.com/docs/2535>; DESCRIPTION: Linear Technology LTC1263CS8#PBF, 1-Channel, Step Up DC-DC Converter, Adjustable 8-Pin, SOIC; HEIGHT: 1.752mm; MANUFACTURER_NAME: Linear Technology; MANUFACTURER_PART_NUMBER: LTC1263CS8#PBF; MOUSER_PART_NUMBER: 584-LTC1263CS8#PBF; MOUSER_PRICE-STOCK: https://www.mouser.co.uk/ProductDetail/Analog-Devices-Linear-Technology/LTC1263CS8PBF?qs=hVkxg5c3xu%2FGCQwEramgmw%3D%3D
IC3 = LM2936QHBMA-5.0_NOPB:LM2936QHBMA-5.0_NOPB: Ultra-Low Quiescent Current LDO Voltage Regulator Source: Datasheet <http://www.ti.com/lit/gpn/lm2936q-q1>; DESCRIPTION: ST Micro LDO Voltage Regulators 5.0V 0.5A Positive; HEIGHT: 1.75mm; MANUFACTURER_NAME: ST Microelectronics; MANUFACTURER_PART_NUMBER: KF50BD-TR; MOUSER_PART_NUMBER: 511-KF50BD-TR; MOUSER_PRICE-STOCK: https://www.mouser.com/ProductDetail/STMicroelectronics/KF50BD-TR?qs=sGAEpiMZZMt1hubY80%2Fs8BMSFdzaUFUoRpw27qJPtVo%3D
J1 J2 = 219-6LPST:219-6LPST: Switch DIP ON OFF SPST 6 Flush Slide 0.1A 20VDC Gull Wing 2.54mm SMD Tube Source: Datasheet; DESCRIPTION: Switch DIP ON OFF SPST 6 Flush Slide 0.1A 20VDC Gull Wing 2.54mm SMD Tube; HEIGHT: 4.2mm; MANUFACTURER_NAME: CTS; MANUFACTURER_PART_NUMBER: 219-6LPST; MOUSER_PART_NUMBER: 774-2196LPST; MOUSER_PRICE-STOCK: https://www.mouser.co.uk/ProductDetail/CTS-Electronic-Components/219-6LPST?qs=qNzHFtQhdJ%252BKgVpfJmEziw%3D%3D
J3-J8 = 219-8MST:219-8MST: DIP Switches / SIP Switches SPST 8 switch sections Source: Datasheet <https://www.ctscorp.com/wp-content/uploads/219.pdf>; DESCRIPTION: DIP Switches / SIP Switches SPST 8 switch sections; HEIGHT: 4.5mm; MANUFACTURER_NAME: CTS; MANUFACTURER_PART_NUMBER: 219-8MST; MOUSER_PART_NUMBER: 774-2198MST; MOUSER_PRICE-STOCK: https://www.mouser.co.uk/ProductDetail/CTS-Electronic-Components/219-8MST/?qs=qNzHFtQhdJ%252B8jOs%2FDCRqeg%3D%3D
K1 K2 = OPL_Switch:SMD-SWITCH-TACTILE-SPST-NO(4P-D6.0MM): 311020004; MPN: DTSM-62K-S-V-T/R(SN431); TYPE: spst
L1-L3 = TLHR4400-AS12Z:TLHR4400-AS12Z: Standard LEDs - Through Hole Red 13mcd; 3mm 612-625nm; 2V Typ Source: Datasheet <https://componentsearchengine.com/Datasheets/2/TLHR4400-AS12Z.pdf>; DESCRIPTION: Standard LEDs - Through Hole Red 13mcd; 3mm 612-625nm; 2V Typ; HEIGHT: 6.1mm; MANUFACTURER_NAME: Vishay; MANUFACTURER_PART_NUMBER: TLHR4400-AS12Z; MOUSER_PART_NUMBER: 78-TLHR4400-AS12Z; MOUSER_PRICE-STOCK: https://www.mouser.co.uk/ProductDetail/Vishay-Semiconductors/TLHR4400-AS12Z?qs=nQ9vpdMXC6AwxmxsGskxgg%3D%3D
L4 = HLMP-3401-E0002:HLMP-3401-E0002: T-1 3/4 SINGLE COLOR LED, YELLOW, 5 mm Source: Datasheet <https://docs.broadcom.com/docs/AV02-1558EN>; COL: yellow; DESCRIPTION: T-1 3/4 SINGLE COLOR LED, YELLOW, 5 mm; HEIGHT: 9.19mm; MANUFACTURER_NAME: Avago Technologies; MANUFACTURER_PART_NUMBER: HLMP-3401-E0002; MOUSER_PART_NUMBER: 630-HLMP-3401-E0002; MOUSER_PRICE-STOCK: https://www.mouser.co.uk/ProductDetail/Broadcom-Avago/HLMP-3401-E0002?qs=jT9z6tsiFNk%252BgYXu%2FQX0fw%3D%3D
L5 = SLR-343DCT32:SLR-343DCT32: Standard LEDs - Through Hole LED AUTO INS 3.1/2.5MM ORNG LENS Source: Datasheet <https://componentsearchengine.com/Datasheets/1/SLR-343DCT32.pdf>; COL: orange; DESCRIPTION: Standard LEDs - Through Hole LED AUTO INS 3.1/2.5MM ORNG LENS; HEIGHT: 5.6mm; MANUFACTURER_NAME: ROHM Semiconductor; MANUFACTURER_PART_NUMBER: SLR-343DCT32; MOUSER_PART_NUMBER: 755-SLR-343DCT32; MOUSER_PRICE-STOCK: https://www.mouser.com/Search/Refine.aspx?Keyword=755-SLR-343DCT32
L6 = 521-9270F:521-9270F: Standard LEDs - Through Hole DISCRETE LED LAMP Source: Datasheet; COL: green; DESCRIPTION: Standard LEDs - Through Hole DISCRETE LED LAMP; HEIGHT: 10mm; MANUFACTURER_NAME: Dialight; MANUFACTURER_PART_NUMBER: 521-9270F; MOUSER_PART_NUMBER: 645-521-9270F; MOUSER_PRICE-STOCK: https://www.mouser.com/Search/Refine.aspx?Keyword=645-521-9270F
LS1 = TP124005-1:TP124005-1: Speakers & Transducers Piezo Transducer Source: Datasheet; DESCRIPTION: Speakers & Transducers Piezo Transducer; HEIGHT: 7.8mm; MANUFACTURER_NAME: DB Unlimited; MANUFACTURER_PART_NUMBER: TP124005-1
PR1 = OPL_Sensor-Transducer:PHOTORESISTOR-5528-10K(2P-5.0X4.2MM): 314020017; MPN: PHOTORESISTOR-5528-10K
Q1-Q3 = PN2222ATF:PN2222ATF: ON Semi PN2222ATF NPN Transistor, 1 A, 40 V, 3-Pin TO-92 Source: Datasheet <https://www.onsemi.com/pub/Collateral/PN2222-D.PDF>; DESCRIPTION: ON Semi PN2222ATF NPN Transistor, 1 A, 40 V, 3-Pin TO-92; HEIGHT: 5.33mm; MANUFACTURER_NAME: ON Semiconductor; MANUFACTURER_PART_NUMBER: PN2222ATF; MOUSER_PART_NUMBER: 512-PN2222ATF; MOUSER_PRICE-STOCK: https://www.mouser.co.uk/ProductDetail/ON-Semiconductor-Fairchild/PN2222ATF/?qs=QwEULm8S1Do17JYDjTNvUQ%3D%3D
R1 R2 = CFR-25JR-52-100R:CFR-25JR-52-100R: Carbon Film Resistors - Through Hole 100ohm 1/4W 5% Source: Datasheet <https://componentsearchengine.com/Datasheets/1/CFR-25JR-52-100R.pdf>; DESCRIPTION: Carbon Film Resistors - Through Hole 100ohm 1/4W 5%; HEIGHT: mm; MANUFACTURER_NAME: YAGEO (PHYCOMP); MANUFACTURER_PART_NUMBER: CFR-25JR-52-100R; MOUSER_PART_NUMBER: 603-CFR-25JR-52100R; MOUSER_PRICE-STOCK: https://www.mouser.com/Search/Refine.aspx?Keyword=603-CFR-25JR-52100R; VAL: 510K
R3 R4 = CFR-25JR-52-100R:CFR-25JR-52-100R: Carbon Film Resistors - Through Hole 100ohm 1/4W 5% Source: Datasheet <https://componentsearchengine.com/Datasheets/1/CFR-25JR-52-100R.pdf>; DESCRIPTION: Carbon Film Resistors - Through Hole 100ohm 1/4W 5%; HEIGHT: mm; MANUFACTURER_NAME: YAGEO (PHYCOMP); MANUFACTURER_PART_NUMBER: CFR-25JR-52-100R; MOUSER_PART_NUMBER: 603-CFR-25JR-52100R; MOUSER_PRICE-STOCK: https://www.mouser.com/Search/Refine.aspx?Keyword=603-CFR-25JR-52100R; VAL: 22K
R5 = CFR-NEW:CFR-25JR-52-100R: Carbon Film Resistors - Through Hole 100ohm 1/4W 5% Source: Datasheet <https://componentsearchengine.com/Datasheets/1/CFR-25JR-52-100R.pdf>; DESCRIPTION: Carbon Film Resistors - Through Hole 100ohm 1/4W 5%; HEIGHT: mm; MANUFACTURER_NAME: YAGEO (PHYCOMP); MANUFACTURER_PART_NUMBER: CFR-25JR-52-100R; MOUSER_PART_NUMBER: 603-CFR-25JR-52100R; MOUSER_PRICE-STOCK: https://www.mouser.com/ProductDetail/Yageo/CFR-25JR-52-220K?qs=%2Fha2pyFaduiUclxQMvctpADd0RPeGi7tTMMkrHXtLPwiTqRb%252BoIJFg%3D%3D; VAL: 220K
R6 = CFR-25JR-52-100R:CFR-25JR-52-100R: Carbon Film Resistors - Through Hole 100ohm 1/4W 5% Source: Datasheet <https://componentsearchengine.com/Datasheets/1/CFR-25JR-52-100R.pdf>; DESCRIPTION: Carbon Film Resistors - Through Hole 100ohm 1/4W 5%; HEIGHT: mm; MANUFACTURER_NAME: YAGEO (PHYCOMP); MANUFACTURER_PART_NUMBER: CFR-25JR-52100R; MOUSER_PART_NUMBER: 603-CFR-25JR-52100R; MOUSER_PRICE-STOCK: https://www.mouser.com/ProductDetail/Yageo/CFR-25JR-52-220K?qs=%2Fha2pyFaduiUclxQMvctpADd0RPeGi7tTMMkrHXtLPwiTqRb%252BoIJFg%3D%3D
R7 R8 = OPL_Resistor:DIP-RES-100R-5%-1/4W(PR-D2.3XL6.5MM): 301020017; MPN: FHCFR-1/4W-101J
R9 R10 = OPL_Resistor:DIP-RES-470R-5%-1/4W(PR-D2.3XL6.5MM): 301020029; MPN: FHCFR-1/4W-471J
R11 R12 = OPL_Resistor:DIP-RES-1K-5%-1/4W(PR-D2.3XL6.5MM): 301020000; MPN: FHCFR-1/4W-102J
R13 R14 = OPL_Resistor:DIP-RES-2.2K-5%-1/4W(PR-D2.3XL6.5MM): 301020010; MPN: FHCFR-1/4W-222J
R15 R16 = OPL_Resistor:DIP-RES-4.7K-5%-1/4W(PR-D2.3XL6.5MM): 301020012; MPN: FHCFR-1/4W-472J
R17 R18 = OPL_Resistor:DIP-RES-10K-5%-1/4W(PR-D2.3XL6.5MM): 301020001; MPN: FHCFR-1/4W-103J
R19-R70 R72 R79-R87 = OPL_Resistor:SMD-RES-5.1K-1%-1/8W(0805): 301012180; MPN: RC0805JR-071KL
R71 = OPL_Resistor:SMD-RES-200R-1%-1/8W(0805): 301012159; MPN: RC0805JR-071KL
R73 = OPL_Resistor:SMD-RES-51K-1%-1/10W(0603): 301012083; MPN: RC0603FR-071K5L; VALUE: 1.5K
R74 = OPL_Resistor:SMD-RES-1K-1%-1/8W(0805): 301012157; LINK: https://statics3.seeedstudio.com/fusion/opl/datasheet/301010311.pdf; MPN: RC0805JR-071KL
SW1 SW2 = OPL_Switch:DIP-TOGGLE-SWITCH-2CH-(2X3P-2.54): 311010004; MPN: MS-22D18 G2 ROHS; TYPE: spdt
U1 U6 = SN74AC04MDREP:SN74AC04MDREP: Enhanced Product Hex Inverters Source: Datasheet <http://www.ti.com/lit/gpn/sn74ac04-ep>; DESCRIPTION: Enhanced Product Hex Inverters; HEIGHT: 1.75mm; MANUFACTURER_NAME: Texas Instruments; MANUFACTURER_PART_NUMBER: SN74AC32MDREP; MOUSER_PART_NUMBER: 595-SN74AC04MDREP; MOUSER_PRICE-STOCK: https://www.mouser.co.uk/ProductDetail/Texas-Instruments/SN74AC04MDREP?qs=2EUPemC2uEFcl2n6MBjlow%3D%3D; VAL: SN74AC32MDREP
U2 U3 = SN74AC04MDREP:SN74AC04MDREP: Enhanced Product Hex Inverters Source: Datasheet <http://www.ti.com/lit/gpn/sn74ac04-ep>; DESCRIPTION: Enhanced Product Hex Inverters; HEIGHT: 1.75mm; MANUFACTURER_NAME: Texas Instruments; MANUFACTURER_PART_NUMBER: SN74AC04MDREP; MOUSER_PART_NUMBER: 595-SN74AC04MDREP; MOUSER_PRICE-STOCK: https://www.mouser.co.uk/ProductDetail/Texas-Instruments/SN74AC04MDREP?qs=2EUPemC2uEFcl2n6MBjlow%3D%3D
U4 U5 = SN74AC08MDREP:SN74AC08MDREP: Enhanced Product Quadruple 2-Input Positive-And Gates Source: Datasheet <http://www.ti.com/lit/gpn/sn74ac08-ep>; DESCRIPTION: Enhanced Product Quadruple 2-Input Positive-And Gates; HEIGHT: 1.75mm; MANUFACTURER_NAME: Texas Instruments; MANUFACTURER_PART_NUMBER: SN74AC08MDREP; MOUSER_PART_NUMBER: 595-SN74AC08MDREP; MOUSER_PRICE-STOCK: https://www.mouser.co.uk/ProductDetail/Texas-Instruments/SN74AC08MDREP?qs=fSCvMSq5ISVx3fDQQO%2Fa4w%3D%3D
U7 = NE555PSRE4:NE555PSRE4: Timers & Support Products Precision Source: Datasheet <http://www.ti.com/lit/ds/symlink/ne555.pdf>; DESCRIPTION: Timers & Support Products Precision; HEIGHT: 2mm; MANUFACTURER_NAME: Texas Instruments; MANUFACTURER_PART_NUMBER: NE555PSRE4; MOUSER_PART_NUMBER: 595-NE555PSRE4; MOUSER_PRICE-STOCK: https://www.mouser.co.uk/ProductDetail/Texas-Instruments/NE555PSRE4?qs=rLYyFdxB%2FmqTKEcMFJ%252BBIw%3D%3D
U8 U9 = SN74AC86DBR:SN74AC86DBR: Quadruple 2-Input Exclusive-OR Gates Source: Datasheet <https://www.ti.com/lit/ds/symlink/sn74ac86.pdf?HQS=dis-dk-null-digikeymode-dsf-pf-null-wwe&ts=1618894237081>; DESCRIPTION: Quadruple 2-Input Exclusive-OR Gates; HEIGHT: 2mm; MANUFACTURER_NAME: Texas Instruments; MANUFACTURER_PART_NUMBER: SN74AC86DBR; MOUSER_PART_NUMBER: 595-SN74AC86DBR; MOUSER_PRICE-STOCK: https://www.mouser.com/Search/Refine.aspx?Keyword=595-SN74AC86DBR
USB = USB3075-30-A:USB3075-30-A: GCT (GLOBAL CONNECTOR TECHNOLOGY) - USB3075-30-A - USB Connector, Micro USB Type B, USB 2.0, Receptacle, 5 Ways, Surface Mount, Right Angle Source: Datasheet <https://componentsearchengine.com/Datasheets/2/USB3075-30-A.pdf>; DESCRIPTION: GCT (GLOBAL CONNECTOR TECHNOLOGY) - USB3075-30-A - USB Connector, Micro USB Type B, USB 2.0, Receptacle, 5 Ways, Surface Mount, Right Angle; HEIGHT: 2.7mm; MANUFACTURER_NAME: GCT (GLOBAL CONNECTOR TECHNOLOGY); MANUFACTURER_PART_NUMBER: USB3075-30-A; MOUSER_PART_NUMBER: 640-USB3075-30-A; MOUSER_PRICE-STOCK: https://www.mouser.co.uk/ProductDetail/GCT/USB3075-30-A?qs=KUoIvG%2F9IlbGMJplbp1ybA%3D%3D

## Net classes
0 default: width 0.152 mm, drill 0.152 mm, clearance 0.152 mm
1 Power: width 0.305 mm, drill 0.152 mm, clearance 0.152 mm to class 0, clearance 0.152 mm